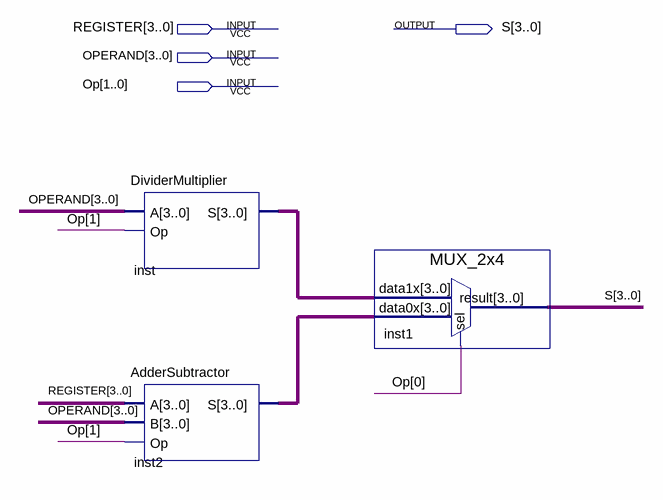
[diagram p0: schematic sheet]
// Quartus schematic ArithmeticLogicUnit.bdf as structural Verilog: 3 symbols, 4 pins
module ArithmeticLogicUnit (
  input  [3:0] REGISTER,
  input  [3:0] OPERAND,
  input  [1:0] Op,
  output [3:0] S
);

  wire [3:0] inst2_s, inst_s;

  DividerMultiplier inst (.A(OPERAND), .Op(Op[1]), .S(inst_s));
  AdderSubtractor inst2 (.A(REGISTER), .B(OPERAND), .Op(Op[1]), .S(inst2_s));
  MUX_2x4 inst1 (.data1x(inst_s), .data0x(inst2_s), .sel(Op[0]), .result(S));
endmodule
